# Altium schematic sheet SdCard.SchDoc
size A
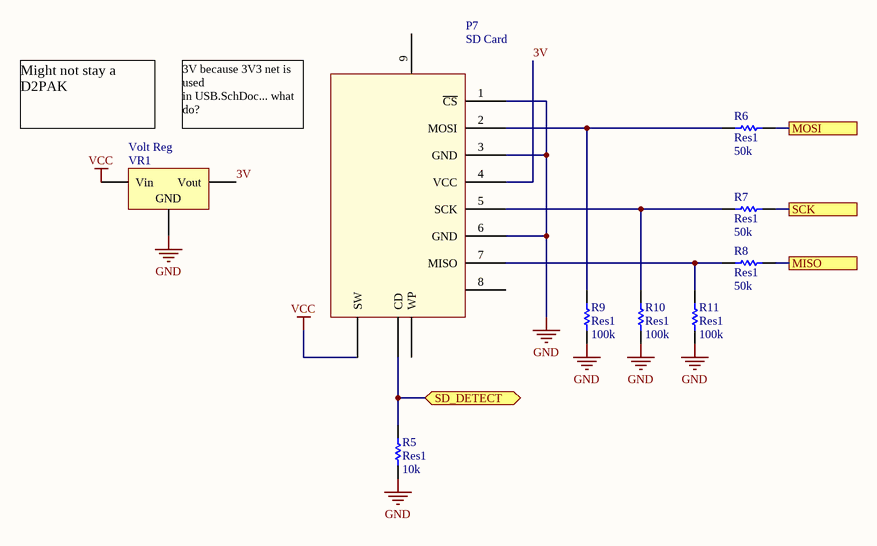
[diagram p0: SdCard.SchDoc]

## Parts
P7  SD Card  [SD_CARD]
R5  Res1  value 10k  [6-0805_L]
R6  Res1  value 50k  [6-0805_N]
R7  Res1  value 50k  [6-0805_N]
R8  Res1  value 50k  [6-0805_N]
R9  Res1  value 100k  [6-0805_N]
R10  Res1  value 100k  [6-0805_N]
R11  Res1  value 100k  [6-0805_N]
VR1  Volt Reg  [D2PAK_N]

## Ports
MISO, MOSI, SCK, SD_DETECT

## Nets
GND: P7.1(~{CS}) P7.3(GND) P7.6(GND) R5.1 R9.2 R10.2 R11.2 VR1.2(GND)
VCC: P7.SW VR1.1(Vin)
3V: P7.4(VCC) VR1.3(Vout)
MISO: R8.1 ; port MISO
MOSI: R6.1 ; port MOSI
SCK: R7.1 ; port SCK
SD_DETECT: P7.CD R5.2 ; port SD_DETECT
NetP7_2: P7.2(MOSI) R6.2 R9.1
NetP7_5: P7.5(SCK) R7.2 R10.1
NetP7_7: P7.7(MISO) R8.2 R11.1

Not connected (* = marked no-connect by the designer): P7 8 9 WP

## Notes on the sheet
- Might not stay a D2PAK
- 3V because 3V3 net is used
  in USB.SchDoc... what do?

## Library data of the parts
R5-R11 = Res1: Resistor; Published: 8-Jun-2000; LatestRevisionDate: 17-Jul-2002; LatestRevisionNote: Re-released for DXP Platform.; PackageReference: AXIAL-0.3; Publisher: Altium Limited; PackageDescription: Axial Device, Thru-Hole; 2 Leads; 0.3 in Pin Spacing
VR1 = Volt Reg: Voltage Regulator; Published: 24-Mar-1999; LatestRevisionDate: 29-May-2009; LatestRevisionNote: IPC-7351 Footprint Added.; PackageReference: D2PAK; Publisher: Altium Limited; PackageDescription: 3-Pin Transistor Outline Package 2.54 mm Pitch, 15.1 mm Lead Span